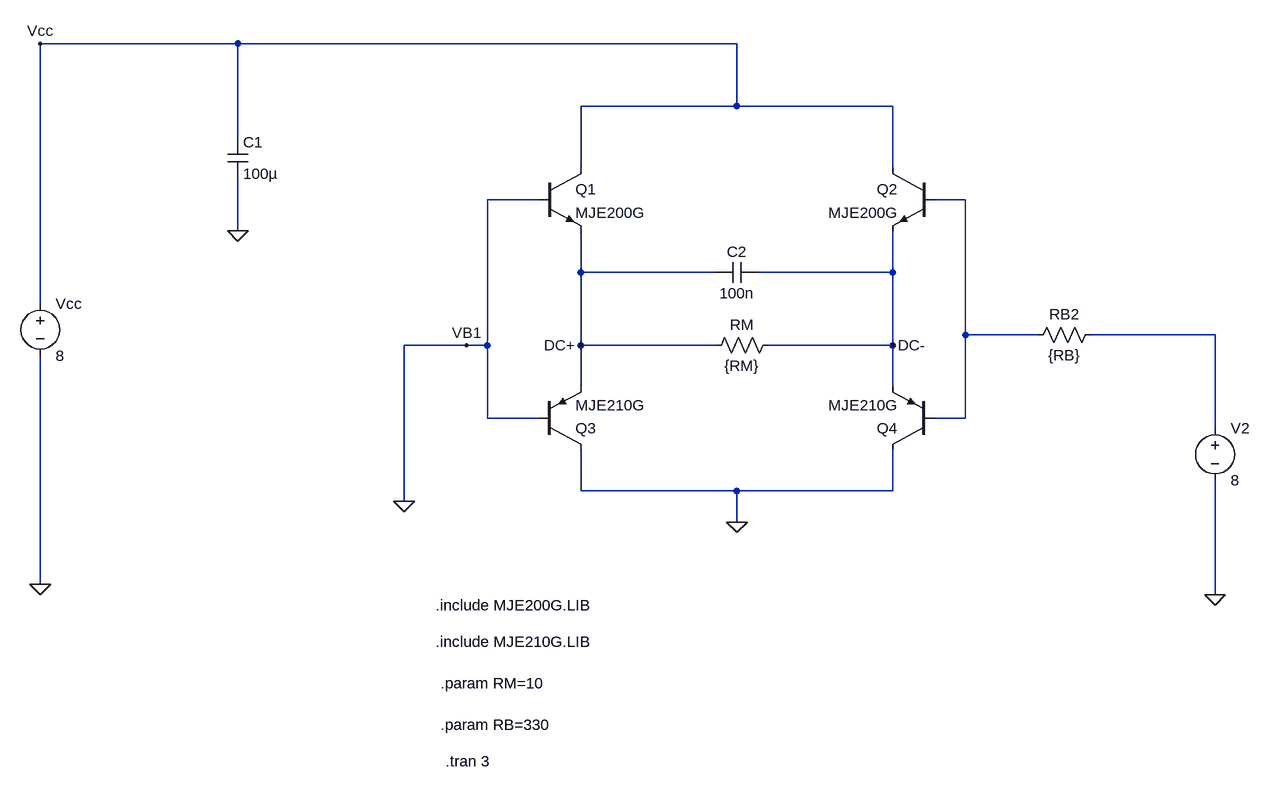
[diagram p0: schematic hbridge-test.asc]
hbridge-test.asc, the LTspice schematic file:
Version 4
SHEET 1 920 872
WIRE -640 -336 -944 -336
WIRE 128 -336 -640 -336
WIRE 128 -240 128 -336
WIRE 128 -240 -112 -240
WIRE 368 -240 128 -240
WIRE -640 -192 -640 -336
WIRE -112 -144 -112 -240
WIRE 368 -144 368 -240
WIRE -176 -96 -256 -96
WIRE 480 -96 432 -96
WIRE -640 -48 -640 -128
WIRE -112 16 -112 -48
WIRE 96 16 -112 16
WIRE 368 16 368 -48
WIRE 368 16 160 16
WIRE -944 64 -944 -336
WIRE 480 112 480 -96
WIRE 592 112 480 112
WIRE 864 112 672 112
WIRE -288 128 -384 128
WIRE -256 128 -256 -96
WIRE -256 128 -288 128
WIRE -112 128 -112 16
WIRE 96 128 -112 128
WIRE 368 128 368 16
WIRE 368 128 176 128
WIRE -112 192 -112 128
WIRE 368 192 368 128
WIRE -256 240 -256 128
WIRE -176 240 -256 240
WIRE 480 240 480 112
WIRE 480 240 432 240
WIRE 864 256 864 112
WIRE -112 352 -112 288
WIRE 128 352 -112 352
WIRE 368 352 368 288
WIRE 368 352 128 352
WIRE -384 368 -384 128
WIRE 128 400 128 352
WIRE -944 496 -944 144
WIRE 864 512 864 336
FLAG -944 496 0
FLAG -640 -48 0
FLAG -288 128 VB1
FLAG -944 -336 Vcc
FLAG 368 128 DC-
FLAG -112 128 DC+
FLAG 128 400 0
FLAG -384 368 0
FLAG 864 512 0
SYMBOL voltage -944 48 R0
SYMATTR InstName Vcc
SYMATTR Value 8
SYMBOL cap -656 -192 R0
SYMATTR InstName C1
SYMATTR Value 100µ
SYMBOL npn -176 -144 R0
SYMATTR InstName Q1
SYMATTR Value MJE200G
SYMBOL pnp -176 288 M180
SYMATTR InstName Q3
SYMATTR Value MJE210G
SYMBOL cap 160 0 R90
WINDOW 0 0 32 VBottom 2
WINDOW 3 32 32 VTop 2
SYMATTR InstName C2
SYMATTR Value 100n
SYMBOL res 192 112 R90
WINDOW 0 0 56 VBottom 2
WINDOW 3 32 56 VTop 2
SYMATTR InstName RM
SYMATTR Value {RM}
SYMBOL pnp 432 288 R180
SYMATTR InstName Q4
SYMATTR Value MJE210G
SYMBOL npn 432 -144 M0
SYMATTR InstName Q2
SYMATTR Value MJE200G
SYMBOL res 576 128 R270
WINDOW 0 32 56 VTop 2
WINDOW 3 0 56 VBottom 2
SYMATTR InstName RB2
SYMATTR Value {RB}
SYMBOL voltage 864 240 R0
SYMATTR InstName V2
SYMATTR Value 8
TEXT -336 528 Left 2 !.include MJE200G.LIB
TEXT -336 584 Left 2 !.include MJE210G.LIB
TEXT -328 648 Left 2 !.param RM=10
TEXT -328 712 Left 2 !.param RB=330
TEXT -320 768 Left 2 !.tran 3

The netlist it stands for:
* hbridge-test.asc
Vcc Vcc 0 8
C1 Vcc 0 100µ
Q1 Vcc 0 DC+ 0 MJE200G
Q3 0 0 DC+ 0 MJE210G
C2 DC- DC+ 100n
RM DC- DC+ {RM}
Q4 0 N001 DC- 0 MJE210G
Q2 Vcc N001 DC- 0 MJE200G
RB2 N001 N002 {RB}
V2 N002 0 8
.model NPN NPN
.model PNP PNP
.lib standard.bjt
.include MJE200G.LIB
.include MJE210G.LIB
.param RM=10
.param RB=330
.tran 3
.backanno
.end